# EAGLE design cc1101duino (EAGLE 7.1.0)

## Sheet 1 of 3
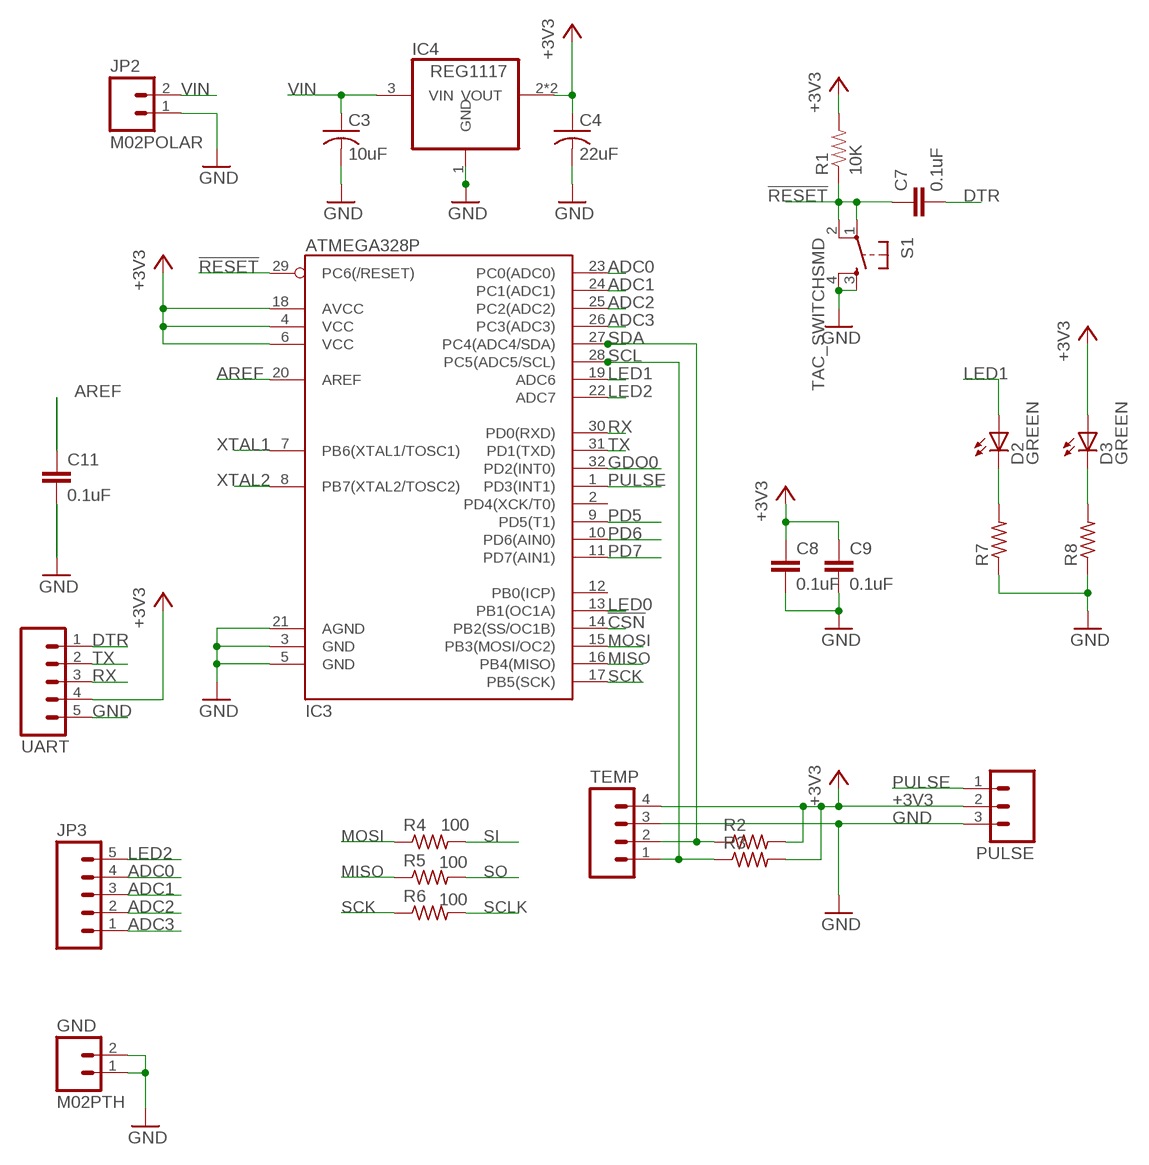
[diagram p0: schematic, sheet 1]

### Parts
C3  10uF  C-USC0805  [C0805]
C4  22uF  C-USC0805  [C0805]
C7  0.1uF  CAP0805  [0805]
C8  0.1uF  CAP0805  [0805]
C9  0.1uF  CAP0805  [0805]
C11  0.1uF  CAP0805  [0805]
D2  GREEN  LED-GREEN0603  [LED-0603]
D3  GREEN  LED-GREEN0603  [LED-0603]
GND  M02PTH  [1X02]
IC3  ATMEGA328P  ATMEGA328_SMT  [TQFP32-08]
IC4  REG1117  [SOT223]
JP2  M02POLAR  [MOLEX-1X2]
JP3  M05PTH  [1X05]
PULSE  M03POLAR  [MOLEX-1X3]
R1  10K  RESISTOR0603-RES  [0603-RES]
R2  R-US_R0805  [R0805]
R3  R-US_R0805  [R0805]
R4  100  R-US_R0603  [R0603]
R5  100  R-US_R0603  [R0603]
R6  100  R-US_R0603  [R0603]
R7  R-US_R0603  [R0603]
R8  R-US_R0603  [R0603]
S1  TAC_SWITCHSMD  [TACTILE-SWITCH-SMD]
TEMP  M04POLAR  [MOLEX-1X4]
UART  M05PTH  [1X05]

### Nets
!CSN: IC3.14(PB2(SS/OC1B)) ; also sheet 3
!RESET: C7.1 IC3.29(PC6(/RESET)) R1.1 S1.1 S1.2
+3V3: C4.1 C8.1 C9.1 D3.A IC3.4(VCC) IC3.6(VCC) IC3.18(AVCC) IC4.2(VOUT) IC4.4(VOUT) PULSE.2 R1.2 R2.2 R3.2 TEMP.4 UART.4 ; also sheet 2,3
ADC0: IC3.23(PC0(ADC0)) JP3.4
ADC1: IC3.24(PC1(ADC1)) JP3.3
ADC2: IC3.25(PC2(ADC2)) JP3.2
ADC3: IC3.26(PC3(ADC3)) JP3.1
AREF: C11.1 IC3.20(AREF)
DTR: C7.2 UART.1
GDO0: IC3.32(PD2(INT0)) ; also sheet 3
GND: C3.2 C4.2 C8.2 C9.2 C11.2 GND.1 GND.2 IC3.3(GND) IC3.5(GND) IC3.21(AGND) IC4.1(GND) JP2.1 PULSE.3 R7.1 R8.1 S1.3 S1.4 TEMP.3 UART.5 ; also sheet 2,3
LED0: IC3.13(PB1(OC1A))
LED1: D2.A IC3.19(ADC6)
LED2: IC3.22(ADC7) JP3.5
MISO: IC3.16(PB4(MISO)) R5.1 ; also sheet 3
MOSI: IC3.15(PB3(MOSI/OC2)) R4.1 ; also sheet 3
N$14: D2.C R7.2
N$15: D3.C R8.2
PD5: IC3.9(PD5(T1))
PD6: IC3.10(PD6(AIN0))
PD7: IC3.11(PD7(AIN1))
PULSE: IC3.1(PD3(INT1)) PULSE.1
RX: IC3.30(PD0(RXD)) UART.3
SCK: IC3.17(PB5(SCK)) R6.1 ; also sheet 3
SCL: IC3.28(PC5(ADC5/SCL)) R3.1 TEMP.1
SCLK: R6.2 ; also sheet 3
SDA: IC3.27(PC4(ADC4/SDA)) R2.1 TEMP.2
SI: R4.2 ; also sheet 3
SO: R5.2 ; also sheet 3
TX: IC3.31(PD1(TXD)) UART.2
VIN: C3.1 IC4.3(VIN) JP2.2
XTAL1: IC3.7(PB6(XTAL1/TOSC1))
XTAL2: IC3.8(PB7(XTAL2/TOSC2))
Unconnected: IC3.2(PD4(XCK/T0)) IC3.12(PB0(ICP))

## Sheet 2 of 3
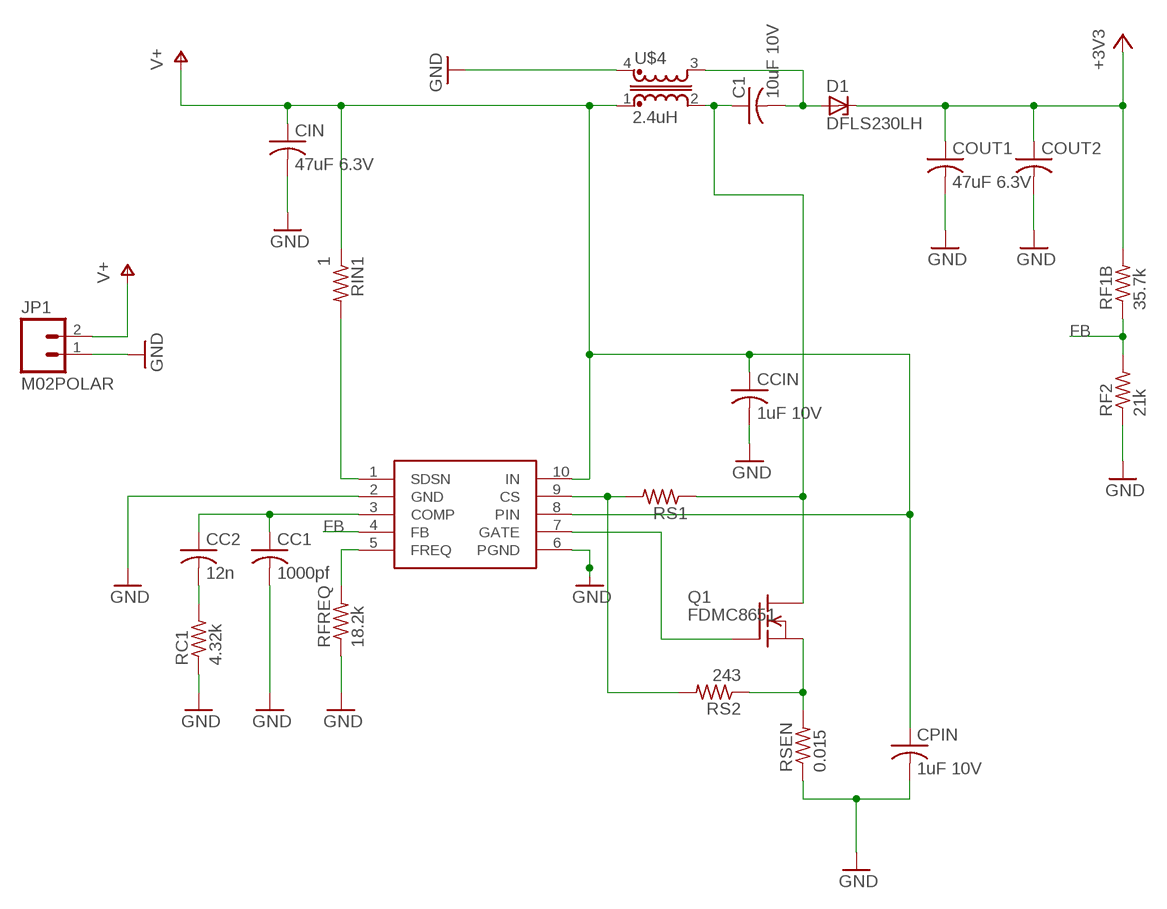
[diagram p1: schematic, sheet 2]

### Parts
C1  10uF 10V  C-USC0805K  [C0805K]
CC1  1000pf  C-USC0805K  [C0805K]
CC2  12n  C-USC0805K  [C0805K]
CCIN  1uF 10V  C-USC0603K  [C0603K]
CIN  47uF 6.3V  C-USC0805K  [C0805K]
COUT1  47uF 6.3V  C-USC0805K  [C0805K]
COUT2  C-USC0805K  [C0805K]
CPIN  1uF 10V  C-USC0603K  [C0603K]
D1  DFLS230LH  [DI123]
JP1  M02POLAR  [MOLEX-1X2]
Q1  FDMC8651  [PP8-3X3]
RC1  4.32k  R-US_R0805  [R0805]
RF1B  35.7k  R-US_R0805  [R0805]
RF2  21k  R-US_R0805  [R0805]
RFREQ  18.2k  R-US_R0805  [R0805]
RIN1  1  R-US_R0805  [R0805]
RS1  R-US_R0805  [R0805]
RS2  243  R-US_R0805  [R0805]
RSEN  0.015  R-US_R0805  [R0805]
U$1  ADP1621  [MSOP10]
U$4  2.4uH  P0175NL  [INDUCTOR]

### Nets
+3V3: COUT1.1 COUT2.1 D1.C RF1B.2 ; also sheet 1,3
C1: C1.2 D1.A U$4.3
FB: RF1B.1 RF2.2 U$1.4(FB)
GND: CC1.2 CCIN.2 CIN.2 COUT1.2 COUT2.2 CPIN.2 JP1.1 RC1.1 RF2.1 RFREQ.1 RSEN.1 U$1.2(GND) U$1.6(PGND) U$4.4 ; also sheet 1,3
N$12: RFREQ.2 U$1.5(FREQ)
N$13: RIN1.2 U$1.1(SDSN)
N$16: Q1.1(S) Q1.2(S) Q1.3(S) RS2.1 RSEN.2
N$20: RS1.2 RS2.2 U$1.9(CS)
N$22: Q1.4(G) U$1.7(GATE)
N$24: CC1.1 CC2.1 U$1.3(COMP)
N$25: CC2.2 RC1.2
N$27: C1.1 Q1.5(D) Q1.6(D) Q1.7(D) Q1.8(D) Q1.9(D) RS1.1 U$4.2
V+: CCIN.1 CIN.1 CPIN.1 JP1.2 RIN1.1 U$1.8(PIN) U$1.10(IN) U$4.1

## Sheet 3 of 3
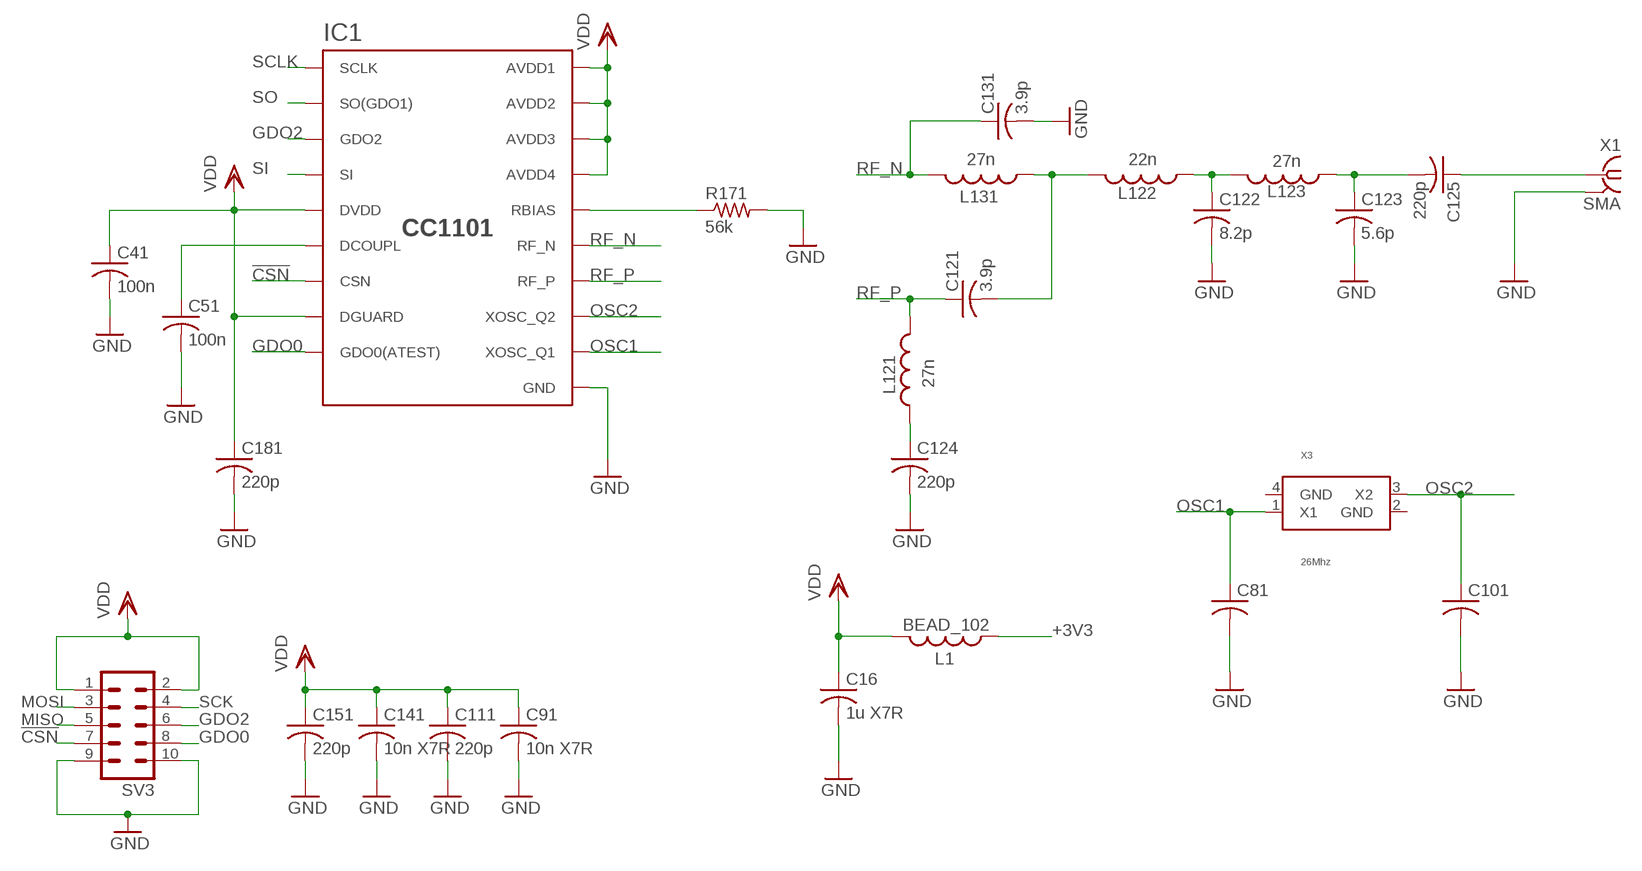
[diagram p2: schematic, sheet 3]

### Parts
C16  1u X7R  C-USC0805  [C0805]
C41  100n  C-USC0402  [C0402]
C51  100n  C-USC0402  [C0402]
C81  C-USC0402  [C0402]
C91  10n X7R  C-USC0402  [C0402]
C101  C-USC0402  [C0402]
C111  220p  C-USC0402  [C0402]
C121  3.9p  C-USC0402  [C0402]
C122  8.2p  C-USC0402  [C0402]
C123  5.6p  C-USC0402  [C0402]
C124  220p  C-USC0402  [C0402]
C125  220p  C-USC0402  [C0402]
C131  3.9p  C-USC0402  [C0402]
C141  10n X7R  C-USC0402  [C0402]
C151  220p  C-USC0402  [C0402]
C181  220p  C-USC0402  [C0402]
IC1  CC1101  [QLP20]
L1  BEAD_102  INDUCTOR0402  [C0402]
L121  27n  INDUCTOR0402  [C0402]
L122  22n  INDUCTOR0402  [C0402]
L123  27n  INDUCTOR0402  [C0402]
L131  27n  INDUCTOR0402  [C0402]
R171  56k  R-US_R0402  [R0402]
SV3  MA05-2  [MA05-2]
X1  SMA  SMA-142-0711-821/826  [J502-ND-142-0711-821/826]
X3  26Mhz  ABM8G  [ABM8G]

### Nets
!CSN: IC1.7(CSN) SV3.7 ; also sheet 1
+3V3: L1.1 ; also sheet 1,2
GDO0: IC1.6(GDO0(ATEST)) SV3.8 ; also sheet 1
GDO2: IC1.3(GDO2) SV3.6
GND: C16.2 C41.2 C51.2 C81.2 C91.2 C101.2 C111.2 C122.2 C123.2 C124.2 C131.2 C141.2 C151.2 C181.2 IC1.16(GND) IC1.19(GND) IC1.GND IC1.GND1(GND) IC1.GND2(GND) IC1.GND3(GND) IC1.GND4(GND) IC1.GND5(GND) R171.2 SV3.9 SV3.10 X1.G@1 X1.G@2 X1.G@3 X1.G@4 ; also sheet 1,2
MISO: SV3.5 ; also sheet 1
MOSI: SV3.3 ; also sheet 1
N$26: C125.1 X1.1
N$30: IC1.17(RBIAS) R171.1
N$31: C51.1 IC1.5(DCOUPL)
N$33: C121.2 L122.2 L131.1
N$34: C124.1 L121.1
N$35: C122.1 L122.1 L123.2
N$36: C123.1 C125.2 L123.1
OSC1: C81.1 IC1.8(XOSC_Q1) X3.1(X1)
OSC2: C101.1 IC1.10(XOSC_Q2) X3.3(X2)
RF_N: C131.1 IC1.13(RF_N) L131.2
RF_P: C121.1 IC1.12(RF_P) L121.2
SCK: SV3.4 ; also sheet 1
SCLK: IC1.1(SCLK) ; also sheet 1
SI: IC1.20(SI) ; also sheet 1
SO: IC1.2(SO(GDO1)) ; also sheet 1
VDD: C16.1 C41.1 C91.1 C111.1 C141.1 C151.1 C181.1 IC1.4(DVDD) IC1.9(AVDD1) IC1.11(AVDD2) IC1.14(AVDD3) IC1.15(AVDD4) IC1.18(DGUARD) L1.2 SV3.1 SV3.2
Unconnected: X3.2(GND) X3.4(GND)

## Library data of the parts
C1 C16 C41 C51 C81 C91 C101 C111 C121-C125 C131 C141 C151 C181 CC1 CC2 CCIN CIN COUT1 COUT2 CPIN = rcl:C-US: CAPACITOR, American symbol
C3 C4 = rcl:C-US: CAPACITOR, American symbol; MPN: 06034D106MAT2A; OC_NEWARK: 10R5934
C7-C9 C11 = SparkFun-Capacitors:CAP: Capacitor Standard 0603 ceramic capacitor, and 0.1" leaded capacitor.; OC_NEWARK: unknown
D1 = IC:DFLS230LH
D2 D3 = SparkFun-LED:LED-GREEN: Various green LEDs 0603- DIO-00821 LARGE- DIO-00862 LILYPAD- DIO-09910; PROD_ID: DIO-00821
GND JP1 JP2 = SparkFun-Connectors:M02: Standard 2-pin 0.1" header. Use with - straight break away headers ( PRT-00116) - right angle break away headers (PRT-00553) - swiss pins (PRT-00743) - machine pins (PRT-00117) - female headers (PRT-00115) Molex polarized connector foot print use with: PRT-08233 with associated crimp pins and housings. 2.54_SCREWTERM for use with PRT-10571. 3.5mm Screw Terminal footprints for PRT-08084 5mm Screw Terminal footprints for use with PRT-08433
IC1 = RoboJackets-RF:CC1101
IC3 = SparkFun-DigitalIC:ATMEGA328_SMT: 32-Pin Atmega328 part Commonly used on Arduino compatible boards Available in QFP and QFN packages TQFP is IC-09069 QFN is non-stock; PROD_ID: IC-09069
IC4 = IC:REG1117: 800mA and 1A Low Dropout (LDO) Positive Regulator 1.8V, 2.5V, 2.85V, 3.3V, 5V, and Adj; MPN: REG1117; OC_FARNELL: 1097566; OC_NEWARK: 14P6981
JP3 UART = SparkFun-Connectors:M05: Header 5 Standard 5-pin 0.1" header. Use with straight break away headers (SKU : PRT-00116), right angle break away headers (PRT-00553), swiss pins (PRT-00743), machine pins (PRT-00117), and female headers (PRT-00115). Molex polarized connector foot print use with SKU : PRT-08230 with associated crimp pins and housings.
L1 L121-L123 L131 = SparkFun-Passives:INDUCTOR: Inductors Basic Inductor/Choke - 0603 and 1206. Footprints are not proven and vary greatly between part numbers.
PULSE = SparkFun-Connectors:M03: Header 3 Standard 3-pin 0.1" header. Use with straight break away headers (SKU : PRT-00116), right angle break away headers (PRT-00553), swiss pins (PRT-00743), machine pins (PRT-00117), and female headers (PRT-00115). Molex polarized connector foot print use with SKU : PRT-08232 with associated crimp pins and housings.
Q1 = IC:FDMC8651
R1 = SparkFun-Passives:RESISTOR: Resistor Basic schematic elements and footprints for 0603, 1206, and PTH resistors.; OC_NEWARK: unknown
R2-R8 = resistor:R-US_: RESISTOR, American symbol
R171 RC1 RF1B RF2 RFREQ RIN1 RS1 RS2 RSEN = rcl:R-US_: RESISTOR, American symbol
S1 = SparkFun-Retired:TAC_SWITCH: Momentary Switch Button commonly used for reset or general input. Spark Fun Electronics SKU : COM-00097 SMT- SWCH-08247; OC_NEWARK: unknown; PROD_ID: SWCH-08247
SV3 = con-lstb:MA05-2: PIN HEADER; OC_FARNELL: unknown; OC_NEWARK: unknown
TEMP = SparkFun-Connectors:M04: Header 4 Standard 4-pin 0.1" header. Use with straight break away headers (SKU : PRT-00116), right angle break away headers (PRT-00553), swiss pins (PRT-00743), machine pins (PRT-00117), and female headers (PRT-00115). Molex polarized connector foot print use with SKU : PRT-08231 with associated crimp pins and housings. 1MM SMD Version SKU: PRT-10208
U$1 = IC:ADP1621
U$4 = IC:P0175NL
X1 = con-coax:SMA-: SMA 50 Ohm End Launch Jack Receptacle - Round Contact Johnson Components Source: www.johnsoncomponents.com .. J502-ND.pdf; MF: JOHNSON COMPONENTS; MPN: 142-0711-821; OC_FARNELL: 1019328; OC_NEWARK: 16F3627
X3 = IC:ABM8G

## Board
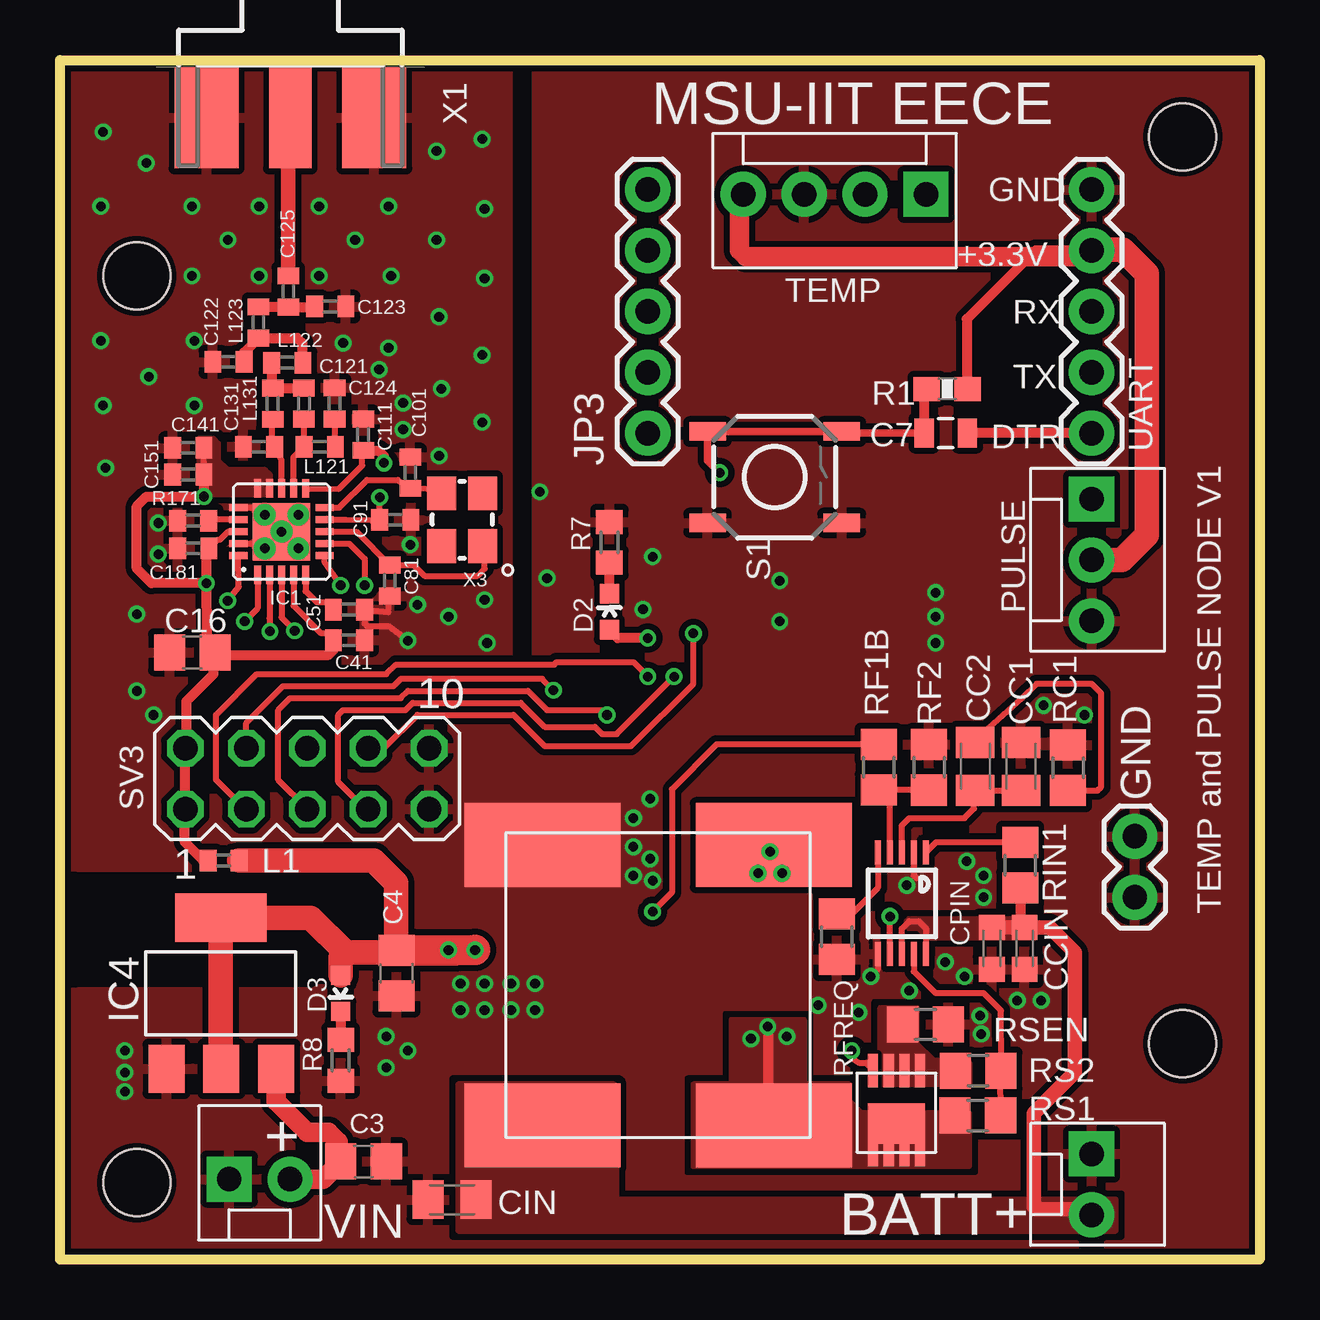
[diagram p3: board, top side]
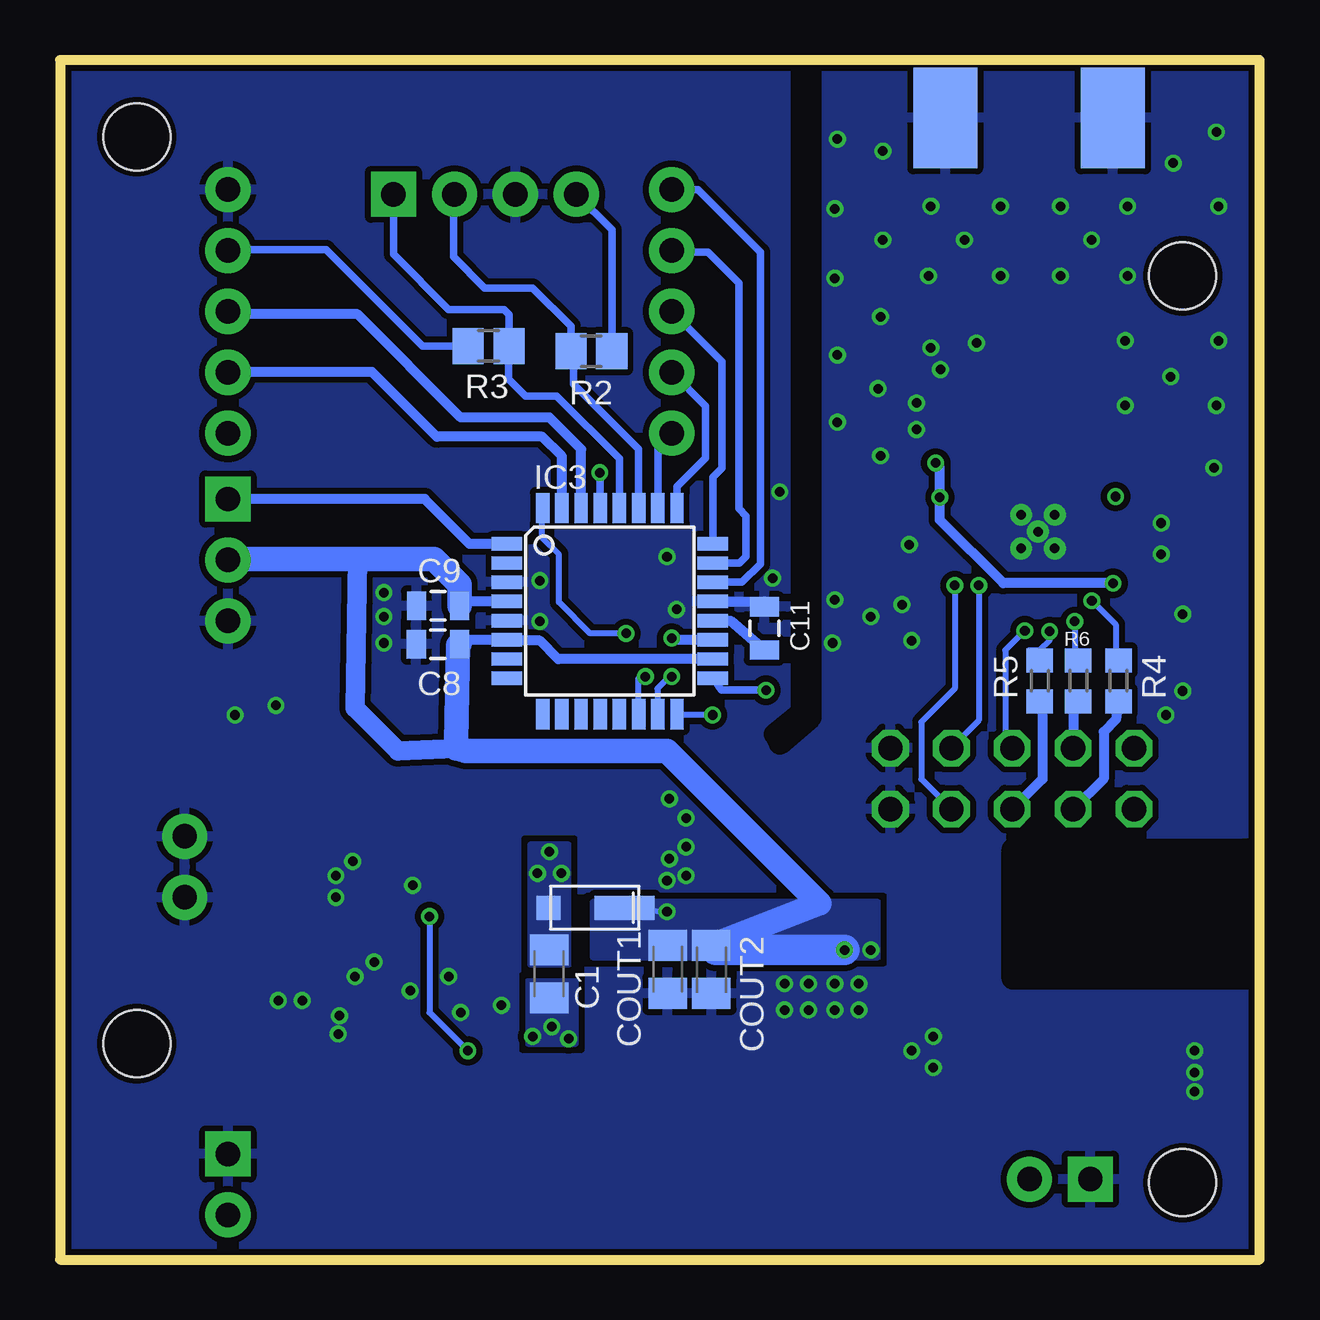
[diagram p4: board, bottom side, seen from below]

Size 50 x 50 mm. Coordinates in mm from the lower left corner, seen from the top.
Outline: 0,50 50,50 50,0 0,0 0,50
Copper layers (1*16): Top 0.035mm / dielectric 1.5mm / Bottom 0.035mm
Design rules "SeeedStudio_2layer_DRU_no_angle_20140221": minimum track width 6mil, minimum drill 12mil, track to track 6mil, track to pad 6mil, pad to pad 6mil, via to via 6mil, smd to smd 0mil, copper to edge 10mil, drill to drill 10mil, minimum pad ring 10mil, minimum via ring 6mil, stop-mask expansion 2mil, vias tented up to drill 100mil, thermal gap 10mil
Holes 2.8 mm at 46.8,46.8 46.8,9 3.2,3.2 3.2,41
tRestrict: area 9.8,13.9 to 9.9,14; area 0.6,11.8 to 10.4,15.7; area 19.2,21.7 to 20.4,49.6
bRestrict: area 9.8,13.9 to 9.9,14; area 0.6,11.7 to 10.3,17.1; area 18.7,21.5 to 20.2,49.8

### Footprints (pad centres in the part's own frame; a part is rotated, then mirrored left to right if it is on the bottom)
C0805K = smd 1.3 x 1.6: 1 -1,0; 2 1,0
C0805 = smd 1.3 x 1.5: 1 -0.95,0; 2 0.95,0
0805 = smd 0.8 x 1.2: 1 -0.9,0; 2 0.9,0
C0402 = smd 0.7 x 0.9: 1 -0.65,0; 2 0.65,0
C0603K = smd 1.05 x 1.08: 1 -0.875,0; 2 0.875,0
DI123 = smd 1 x 1: A -1.925,0 | smd 2.5 x 1: C 1.25,0
LED-0603 = smd 0.8 x 0.8: A 0,-0.75; C 0,0.75
1X02 = drill 1.016 pad 1.88: 1 0,0; 2 2.54,0
QLP20 = smd 0.76 x 0.28: 1 -1.8,1; 2 -1.8,0.5; 3 -1.8,0; 4 -1.8,-0.5; 5 -1.8,-1; 11 1.8,-1; 12 1.8,-0.5; 13 1.8,0; 14 1.8,0.5; 15 1.8,1 | smd 0.28 x 0.76: 6 -1,-1.8; 7 -0.5,-1.8; 8 0,-1.8; 9 0.5,-1.8; 10 1,-1.8; 16 1,1.8; 17 0.5,1.8; 18 0,1.8; 19 -0.5,1.8; 20 -1,1.8 | smd 2.4 x 2.4: GND 0,0 | drill 0.4: GND1 0,0; GND2 -0.7,0.7; GND3 0.7,0.7; GND4 -0.7,-0.7; GND5 0.7,-0.7
TQFP32-08 = smd 1.27 x 0.559: 1 -4.293,2.8; 2 -4.293,2; 3 -4.293,1.2; 4 -4.293,0.4; 5 -4.293,-0.4; 6 -4.293,-1.2; 7 -4.293,-2; 8 -4.293,-2.8; 17 4.293,-2.8; 18 4.293,-2; 19 4.293,-1.2; 20 4.293,-0.4; 21 4.293,0.4; 22 4.293,1.2; 23 4.293,2; 24 4.293,2.8 | smd 0.559 x 1.27: 9 -2.8,-4.293; 10 -2,-4.293; 11 -1.2,-4.293; 12 -0.4,-4.293; 13 0.4,-4.293; 14 1.2,-4.293; 15 2,-4.293; 16 2.8,-4.293; 25 2.8,4.293; 26 2,4.293; 27 1.2,4.293; 28 0.4,4.293; 29 -0.4,4.293; 30 -1.2,4.293; 31 -2,4.293; 32 -2.8,4.293
SOT223 = smd 1.499 x 2.007: 1 -2.261,-3.15; 2 0.025,-3.15; 3 2.311,-3.15 | smd 3.81 x 2.007: 4 0,3.15
MOLEX-1X2 = drill 1.016 pad 1.88 square: 1 0,0 | drill 1.016 pad 1.88: 2 2.54,0
1X05 = drill 1.016 pad 1.88: 1 0,0; 2 2.54,0; 3 5.08,0; 4 7.62,0; 5 10.16,0
MOLEX-1X3 = drill 1.016 pad 1.88 square: 1 0,0 | drill 1.016 pad 1.88: 2 2.54,0; 3 5.08,0
PP8-3X3 = smd 0.42 x 1.4: 1 -0.975,-1.75; 2 -0.325,-1.75; 3 0.325,-1.75; 4 0.975,-1.75; 5 0.975,1.525; 6 0.325,1.525; 7 -0.325,1.525; 8 -0.975,1.525 | smd 2.37 x 1.7: 9 0,0.45
0603-RES = smd 1.1 x 1: 1 -0.85,0; 2 0.85,0
R0805 = smd 1.3 x 1.5: 1 -0.85,0; 2 0.85,0
R0603 = smd 1 x 1.1: 1 -0.85,0; 2 0.85,0
R0402 = smd 0.7 x 0.9: 1 -0.65,0; 2 0.65,0
R0805' = smd 1.3 x 1.5: 1 -0.95,0; 2 0.95,0
TACTILE-SWITCH-SMD = smd 1.524 x 0.762: 1 -2.794,1.905; 2 2.794,1.905; 3 -2.794,-1.905; 4 2.794,-1.905
MA05-2 = drill 1.016 octagon: 1 -5.08,-1.27; 2 -5.08,1.27; 3 -2.54,-1.27; 4 -2.54,1.27; 5 0,-1.27; 6 0,1.27; 7 2.54,-1.27; 8 2.54,1.27; 9 5.08,-1.27; 10 5.08,1.27
MOLEX-1X4 = drill 1.016 pad 1.88 square: 1 0,0 | drill 1.016 pad 1.88: 2 2.54,0; 3 5.08,0; 4 7.62,0
MSOP10 = smd 0.25 x 1: 1 -1,-2.113; 2 -0.5,-2.113; 3 0,-2.113; 4 0.5,-2.113; 5 1,-2.113; 6 1,2.113; 7 0.5,2.113; 8 0,2.113; 9 -0.5,2.113; 10 -1,2.113
INDUCTOR = smd 6.5 x 3.5: 1 4.825,5.84; 2 -4.825,5.84; 3 -4.825,-5.84; 4 4.825,-5.84
J502-ND-142-0711-821/826 = smd 4.191 x 1.778: 1 2.115,0 | smd 4.191 x 2.667: G@1 2.115,3.495; G@2 2.115,-3.495 | smd 4.191 x 2.667 bottom: G@3 2.115,3.495; G@4 2.115,-3.495
ABM8G = smd 1.4 x 1.2: 1 -1.1,-0.85; 2 1.1,-0.85; 3 1.1,0.85; 4 -1.1,0.85

### Placement (x,y rotation side)
C1  29.61,11.91 90 bottom
C3  12.65,4.09 0 top
C4  14.03,11.94 270 top
C7  36.92,34.45 0 top
C8  34.25,25.65 180 bottom
C9  34.24,27.25 180 bottom
C11  20.64,26.31 90 bottom
C16  5.52,25.3 180 top
C41  12.05,25.81 0 top
C51  12.05,27.09 0 top
C81  13.75,28.3 270 top
C91  13.98,30.83 0 top
C101  14.6,32.8 90 top
C111  12.64,34.38 90 top
C121  10.17,35.68 90 top
C122  7.02,37.42 180 top
C123  11.27,39.72 0 top
C124  11.45,35.69 90 top
C125  9.52,40.35 270 top
C131  8.29,33.88 180 top
C141  5.35,33.83 180 top
C151  5.35,32.72 180 top
C181  5.56,29.64 180 top
CC1  40.06,20.56 90 top
CC2  38.15,20.55 90 top
CCIN  40.21,12.97 270 top
CIN  16.34,2.5 180 top
COUT1  24.67,12.1 270 bottom
COUT2  22.85,12.09 270 bottom
CPIN  38.84,12.96 270 top
D1  27.71,14.67 0 bottom
D2  22.9,27 0 top
D3  11.7,11.1 180 top
GND  44.8,15.1 90 top
IC1  9.24,30.34 90 top
IC3  27.08,27.03 0 bottom
IC4  6.7,11.1 0 top
JP1  43,4.4 270 top
JP2  7.05,3.35 0 top
JP3  24.5,34.44 90 top
L1  6.82,16.63 180 top
L121  10.83,33.88 180 top
L122  9.47,37.38 180 top
L123  8.28,39.06 270 top
L131  8.87,35.67 270 top
PULSE  43,31.7 270 top
Q1  34.87,6.12 180 top
R1  36.98,36.29 0 top
R2  27.85,37.86 0 bottom
R3  32.13,38.08 180 bottom
R4  5.88,24.12 90 bottom
R5  9.16,24.12 90 bottom
R6  7.56,24.12 90 bottom
R7  22.9,29.9 270 top
R8  11.7,8.3 90 top
R171  5.55,30.8 180 top
RC1  4.32k  [R0805']  42.02,20.5 270 top
RF1B  35.7k  [R0805']  34.13,20.52 90 top
RF2  21k  [R0805']  36.22,20.51 270 top
RFREQ  18.2k  [R0805']  32.38,13.46 90 top
RIN1  1  [R0805']  40.03,16.44 90 top
RS1  [R0805']  38.26,6 0 top
RS2  243  [R0805']  38.27,7.87 0 top
RSEN  0.015  [R0805']  36.08,9.8 180 top
S1  29.79,32.61 0 top
SV3  10.3,20.04 0 top
TEMP  36.1,44.4 180 top
U$1  35.09,14.85 180 top
U$4  24.93,11.43 180 top
UART  43,34.44 90 top
X1  9.6,49.7 270 top
X3  16.76,30.84 90 top

### Tracks (layer width: path | path; a pad name or v marks a point on that pad's centre or on a via)
!CSN  (via drill 0.4)
  Top 0.254: IC1.7 12.06,29.84 12.7,29.2 v12.7,28.1 | v25.6,24.3 23.2,21.9 22.6,21.9 22.3,22.2 20.2,22.2 19.2,23.2 14.7,23.2 14.4,22.9 11.8,22.9 11.6,22.7 11.6,19.9 12.72,18.77 SV3.7
  Bottom 0.254: v12.7,28.1 12.7,23.8 14.1,22.4 14.1,20.03 SV3.7 | v25.6,24.3 25.8,24.3 25.9,24.2 25.9,22.76 IC3.14
!RESET  (via drill 0.4)
  Top 0.305: v27.5,32.8 27,33.3 S1.1 S1.2 32.65,34.45 C7.1
  Top 0.406: C7.1 36.02,36.18 R1.1
  Bottom 0.305: IC3.29 27.5,31.34 v27.5,32.8
+3V3  (via drill 0.4)
  Top 0.254: RF1B.2 27.37,21.47 25.5,19.6 25.5,15.3 v24.7,14.5
  Top 0.406: UART.4 40.66,42.06 37.8,39.2 37.8,36.32 R1.2
  Top 0.813: UART.4 42.74,41.8 28.6,41.8 28.33,42.07 28.33,44.25 TEMP.4
  Top 1.016: 13.99,12.85 C4.1 | L1.1 13.07,16.63 14,15.7 14,12.92 C4.1 | IC4.2 6.7,8.68 IC4.4 10.45,14.25 11.9,12.8 | 11.9,12.8 13.94,12.8 C4.1 | D3.A 11.7,12.6 11.9,12.8 | PULSE.2 44.26,29.16 45.3,30.2 45.3,41.1 44.3,42.1 43.04,42.1 UART.4
  Top 1.27: C4.1 16.49,12.89 v17.3,12.9
  Bottom 0.254: v24.7,14.5 25.6,14.53 D1.C
  Bottom 0.305: R2.2 27,42.92 TEMP.4 | R3.2 34.88,38.08 38.9,42.1 42.96,42.1 UART.4
  Bottom 0.406: IC3.4 33.16,27.43 C9.1 | IC3.18 29.23,25.03 30,25.8 31.34,25.8 IC3.6 33.17,25.83 C8.1
  Bottom 0.813: 33.5,21.3 35.9,21.2 37.7,23 37.6,29.2
  Bottom 1.016: COUT2.1 18.35,14.85 24.7,21.2 33.1,21.2 33.5,21.3 33.5,21.6 33.4,25.6 C8.1 | C9.1 33.34,28.14 34.4,29.2 37.6,29.2 42.36,29.2 PULSE.2 | 43.04,42.1 UART.4
  Bottom 1.27: v17.3,12.9 22.66,12.9 COUT2.1
  other vias: 16.2,12.9
  pour Bottom (no thermals): 27.8,12.6 15.9,12.6 15.9,14.9 27.8,14.9
ADC0
  Bottom 0.305: IC3.23 21.67,29.03 21.4,29.3 21.4,31 21.7,31.3 21.7,40.7 23,42 24.44,42 JP3.4
ADC1
  Bottom 0.305: IC3.24 22.79,32.61 22.4,33 22.4,37.42 JP3.3
ADC2
  Bottom 0.305: IC3.25 24.28,32.22 23.1,33.4 23.1,35.58 JP3.2
ADC3
  Bottom 0.305: IC3.26 25.08,33.86 JP3.1
AREF
  Bottom 0.406: IC3.20 22.06,26.63 C11.1
C1  (via drill 0.4)
  Top 0.254: v29.6,17 29.63,17.2 U$4.3
  other vias: 30.1,16.1 29.1,16.1
  pour Bottom (no thermals): 30.4,12.3 28.8,12.3 28.8,17.3 30.4,17.3
DTR
  Top 0.406: UART.1 37.84,34.44 C7.2
FB
  Top 0.254: U$1.4 34.59,19.51 RF1B.1 34.53,19.56 RF2.2
GDO0  (via drill 0.4)
  Top 0.254: IC1.6 11.02,29.08 v11.7,28.1 | SV3.8 13.52,21.32 14.9,22.7 18.9,22.7 20.2,21.4 23.8,21.4 26.4,24 v26.4,26.1
  Bottom 0.254: v11.7,28.1 11.7,22.47 SV3.8 | v26.4,26.1 27.9,26.1 29.2,27.4 29.2,29.4 29.9,30.1 29.9,31.3 IC3.32
GDO2  (via drill 0.4)
  Top 0.254: IC1.3 9.24,26.76 v9.78,26.21
  Bottom 0.254: v9.78,26.21 10.6,25.4 10.6,21.81 SV3.6
GND  (via drill 0.4)
  Top 0.254: IC1.16 8.6,31.34 IC1.GND3 | IC1.19 8.47,29.84 IC1.GND2 | C81.2 13.69,26.99 C51.2 12.7,26.5 12.8,26.4 13.7,26.4 v14.5,25.8 | U$1.2 35.59,16.01 35.7,15.9 | U$1.6 34.09,12.09 v33.8,11.8
  Bottom 0.406: IC3.21 20.62,27.43 C11.2
  other vias: 1.9,33 1.8,35.6 1.7,38.3 3.7,36.8 1.7,43.9 3.9,22.7 4.1,29.4 14.6,29.8 16.2,26.8 4.1,30.7 5.6,35.6 5.6,38.3 8.3,41 5.5,43.9 7,42.5 3.2,26.9 3.2,23.7 8.3,43.9 11.8,38.2 13.3,37.1 15.8,33.5 17.7,43.8 14.3,34.6 14.3,35.7 15.9,36.3 15.8,39.3 13.7,38 10.8,41 12.3,42.5 10.8,43.9 17.7,27.5 38.5,15.1 38.5,16 39.9,10.8 38.35,10.16 38.4,9.4 36.9,12.4 33.3,10.3 31.6,10.6 35.3,15.6 37.8,16.6 37.7,11.8 2.7,7 2.7,7.8 23.9,16 2.7,8.7 24.7,15.8 13.6,8 13.6,9.3 14.5,8.7 17.7,40.9 17.6,34.9 17.6,46.7 17.6,37.7 17.8,25.7 3.6,45.7 14.9,27.3 15.7,46.2 1.8,47 35.4,11.2 36.5,27.8 36.5,26.8 19.8,11.5 19.8,10.4 18.8,11.5 18.8,10.4 17.7,11.5 17.7,10.4 16.7,11.5 16.7,10.4 30,28.3 30,26.6 24.3,27.1 20.3,28.4 20,32 24.7,29.3 23.9,17.2 24.6,16.7 23.9,18.4 24.6,19.2 41,23.1 42.7,22.7 36.5,25.7 40.9,10.8 5.5,41 13.7,43.9 13.8,41 15.7,42.5
  pour Top (isolate 0.254, rank 3): 50,50 50,0 0,0 0,50
  pour Bottom (isolate 0.254, rank 3): 50,50 50,0 0,0 0,50
  pour Top (rank 3, no thermals): 16.6,19.9 24.1,19.9 24.1,15 16.6,15
LED1  (via drill 0.4)
  Top 0.406: v24.5,25.9 23.25,25.9 D2.A
  Bottom 0.406: IC3.19 24.43,25.83 v24.5,25.9
LED2
  Bottom 0.305: IC3.22 21.57,28.23 20.8,29 20.8,42 23.4,44.6 JP3.5
MISO  (via drill 0.4)
  Top 0.254: v22.8,22.7 22.6,22.9 20.3,22.9 19.5,23.7 14.5,23.7 14.2,23.4 9.6,23.4 9.1,22.9 9.1,20 10.3,18.8 SV3.5
  Bottom 0.254: v22.8,22.7 24.24,22.7 IC3.16
  Bottom 0.406: R5.1 9.07,23.2 9.05,22.28 9.05,20.03 SV3.5
MOSI  (via drill 0.4)
  Top 0.254: SV3.3 7.76,18.86 7.64,18.86 6.5,20 6.5,22.7 8.2,24.4 13.6,24.4 14,24.8 20.6,24.8 20.7,24.9 23.9,24.9 v24.5,24.3
  Bottom 0.254: v24.5,24.3 24.6,24.3 25.1,23.8 25.1,22.76 IC3.15
  Bottom 0.406: R4.1 5.98,22.52 6.5,22 6.5,20.04 SV3.3
N$12
  Top 0.254: U$1.5 34.09,15.49 32.9,14.3 32.19,14.3 RFREQ.2
N$13
  Top 0.254: RIN1.2 36.51,17.39 U$1.1
N$14
  Top 0.406: D2.C R7.2
N$15
  Top 0.406: D3.C R8.2
N$16
  pour Top (no thermals): 37.9,7.3 34.2,7.3 34.2,10.5 35.7,10.5 35.7,9 36.4,8.3 37.8,8.3 37.9,8.2
N$20
  Top 0.254: RS1.2 38.91,6 39.21,6.31 39.2,7.45 RS2.2 39.08,7.97 39.23,8.12 39.22,10.38 38.5,11.1 36.5,11.1 35.59,12.01 U$1.9
N$22  (via drill 0.4)
  Top 0.254: U$1.7 v34.59,14.29 v34.6,14.3 | v33,8.7 33,8.4 33.3,8.2 33.62,8.2 Q1.4
  Bottom 0.254: v34.6,14.3 34.6,10.3 v33,8.7
N$24
  Top 0.254: U$1.3 35.09,18.09 35.4,18.4 37.7,18.4 38.1,18.8 38.1,19.5 CC2.1 CC1.1
N$25
  Top 0.254: RC1.2 43.25,19.55 43.4,19.7 43.4,23.6 43,24 40.7,24 40.1,23.4 38.1,21.61 CC2.2
N$26
  Top 0.61: C125.1 9.52,47.05
  Top 1.016: 9.52,47.05 X1.1
N$27  (via drill 0.4)
  Top 0.406: v29.5,9.7 29.5,5.65 U$4.2
  other vias: 30.3,9.3 28.8,9.2
  pour Top (no thermals): 37.9,6.1 33.4,6.1 32.9,6.6 32.9,7.3 26.4,7.3 26.4,3.9 37.9,3.9
  pour Bottom (no thermals): 28.5,9 28.5,11.6 30.5,11.6 30.5,9
  pour Top (no thermals): 28,7.3 28,10 31,10 31,7.4
N$30
  Top 0.254: IC1.17 6.25,30.84 R171.1
N$31
  Top 0.254: IC1.5 10.24,27.86 10.7,27.4 11.38,27.4 C51.1
N$33
  Top 0.406: L122.2 8.82,36.37 L131.1 C121.2
N$34
  Top 0.254: L121.1 11.48,34.71 C124.1
N$35
  Top 0.406: C122.1 7.67,37.81 L123.2 9.89,38.41 10.1,38.2 10.1,37.41 L122.1
N$36
  Top 0.406: L123.1 9.51,39.71 C125.2 10.59,39.7 C123.1
OSC1
  Top 0.254: IC1.8 12.36,30.34 C81.1 14.75,28.95 15.2,28.5 17.4,28.5 17.7,28.8 17.7,29.73 X3.1
OSC2
  Top 0.254: X3.3 15.93,32.12 C101.1 14.08,32.5 12.8,32.5 11.64,31.34 IC1.10
PULSE
  Bottom 0.406: IC3.1 32.93,29.83 34.8,31.7 PULSE.1
RF_N
  Top 0.254: IC1.13 9.24,33.28 C131.1 8.84,34.35 L131.2
RF_P
  Top 0.254: IC1.12 9.74,33.44 L121.2 10.18,34.73 C121.1
RX
  Bottom 0.406: IC3.30 28.28,33.78 29.6,35.1 33.3,35.1 37.6,39.4 42.88,39.4 UART.3
SCK  (via drill 0.4)
  Top 0.254: SV3.4 7.76,22.36 9.3,23.9 13.9,23.9 14.2,24.2 20.1,24.2 v20.57,23.73
  Bottom 0.305: IC3.17 22.43,23.73 v20.57,23.73
  Bottom 0.406: R6.1 7.53,23.27 7.76,23 SV3.4
SCL
  Bottom 0.305: IC3.28 26.68,33.38 29.3,36 30.6,36 31.3,36.7 31.3,38.06 R3.1 31.28,39.38 31.5,39.6 33.8,39.6 36.1,41.9 TEMP.1
SCLK  (via drill 0.4)
  Top 0.254: IC1.1 8.24,27.14 v7.7,26.6
  Bottom 0.254: v7.7,26.6 7.7,25.33 R6.2
SDA
  Bottom 0.305: IC3.27 25.88,33.78 28.6,36.5 28.6,37.76 R2.1 28.7,38.9 30.3,40.5 32.3,40.5 33.6,41.8 33.6,44.36 TEMP.2
SI  (via drill 0.4)
  Top 0.254: 7.34,29.34 IC1.20 7.45,28.04 v6.99,27.46
  Bottom 0.254: R4.2 6,25.29 6,26.47 v6.99,27.46
SO  (via drill 0.4)
  Top 0.254: IC1.2 8.74,26.74 v8.75,26.18
  Bottom 0.254: R5.2 9.6,25.3 9.6,25.4 9.16,25.4 8.75,25.81 v8.75,26.18
TX
  Bottom 0.406: IC3.31 29.08,33.48 29.9,34.3 34.3,34.3 37,37 42.98,37 UART.2
V+
  Top 0.254: U$1.8 35.09,13.79 35.4,14.1 35.8,14.1 36.06,13.84 | 36.1,13.8 36.1,12.74 U$1.10
  Top 0.406: RIN1.1 40.03,13.92 CCIN.1 | 38.75,13.85 CPIN.1
  Top 0.61: 38.75,13.85 CCIN.1 41.25,13.85 42.3,12.8 42.3,7.8 40.6,6.1 40.6,2.2 40.7,2.1 42.76,2.1 JP1.2
  pour Top (no thermals): 23.1,7.3 16.6,7.3 16.6,1.2 44,1.2 44,2.5 23.2,2.5 23.2,7.2
  pour Top (no thermals): 40.6,13.4 36.2,13.4 35.8,13.8 35.4,13.8 35.3,13.9 35.3,14.1 35.4,14.2 40.6,14.2
VDD  (via drill 0.4)
  Top 0.254: IC1.11 11.62,32.12 12.6,33.1 12.6,33.69 C111.1 | C151.1 6,33.23 C141.1 | IC1.9 11.92,30.84 C91.1 13.33,31.27 v13.33,31.77 | IC1.4 9.74,27.25 10.89,26.1 11.3,26.1 11.38,25.8 C41.1 | IC1.18 7,30.34 6.66,30 6.56,30 C181.1
  Top 0.406: C181.1 6.1,29.6 v6.1,28.19 | v6.1,28.19 6.11,26.07 C16.1 | C16.1 6.47,25.11 6.69,25.11 6.9,25.2 11.2,25.2 11.4,25.4 11.4,25.71 C41.1 | 13.1,30.8 C91.1 | C151.1 6,32.12 v6,31.8 3.6,31.8 3.2,31.4 3.2,28.8 3.81,28.19 v6.1,28.19 | C16.1 6.4,25.23 6.4,24.4 5.28,23.28 5.28,21.37 SV3.2 SV3.1 5.2,18.75 5.2,17.4 5.97,16.63 L1.2 | v13.5,33.2 13.5,33.5 13.3,33.7 12.67,33.7 C111.1
  Bottom 0.406: 5.9,31.8 v6,31.8 | v13.5,33.2 13.33,33.03 v13.33,31.77 C91.1 10.69,28.19 v6.1,28.19
  pour Top (no thermals): 8.75,32.11 8.75,32.71 8.56,32.9 7,32.9 6.6,33.3 6.6,34 6.4,34.2 5.8,34.2 5.8,32.4 5.9,32.3 5.9,31.9 8.6,31.9
VIN
  Top 0.813: JP2.2 10.96,3.35 C3.1 11.6,4.19 11.6,4.9 11.2,5.3 10.3,5.3 9.01,6.59 IC4.3

### Text on the board
tPlace: MSU-IIT EECE | GND | +3.3V | TEMP | RX | TX | DTR | TEMP and PULSE NODE V1 | + | BATT | VIN | +